# EAGLE design Tempus B (EAGLE 7.6.0)
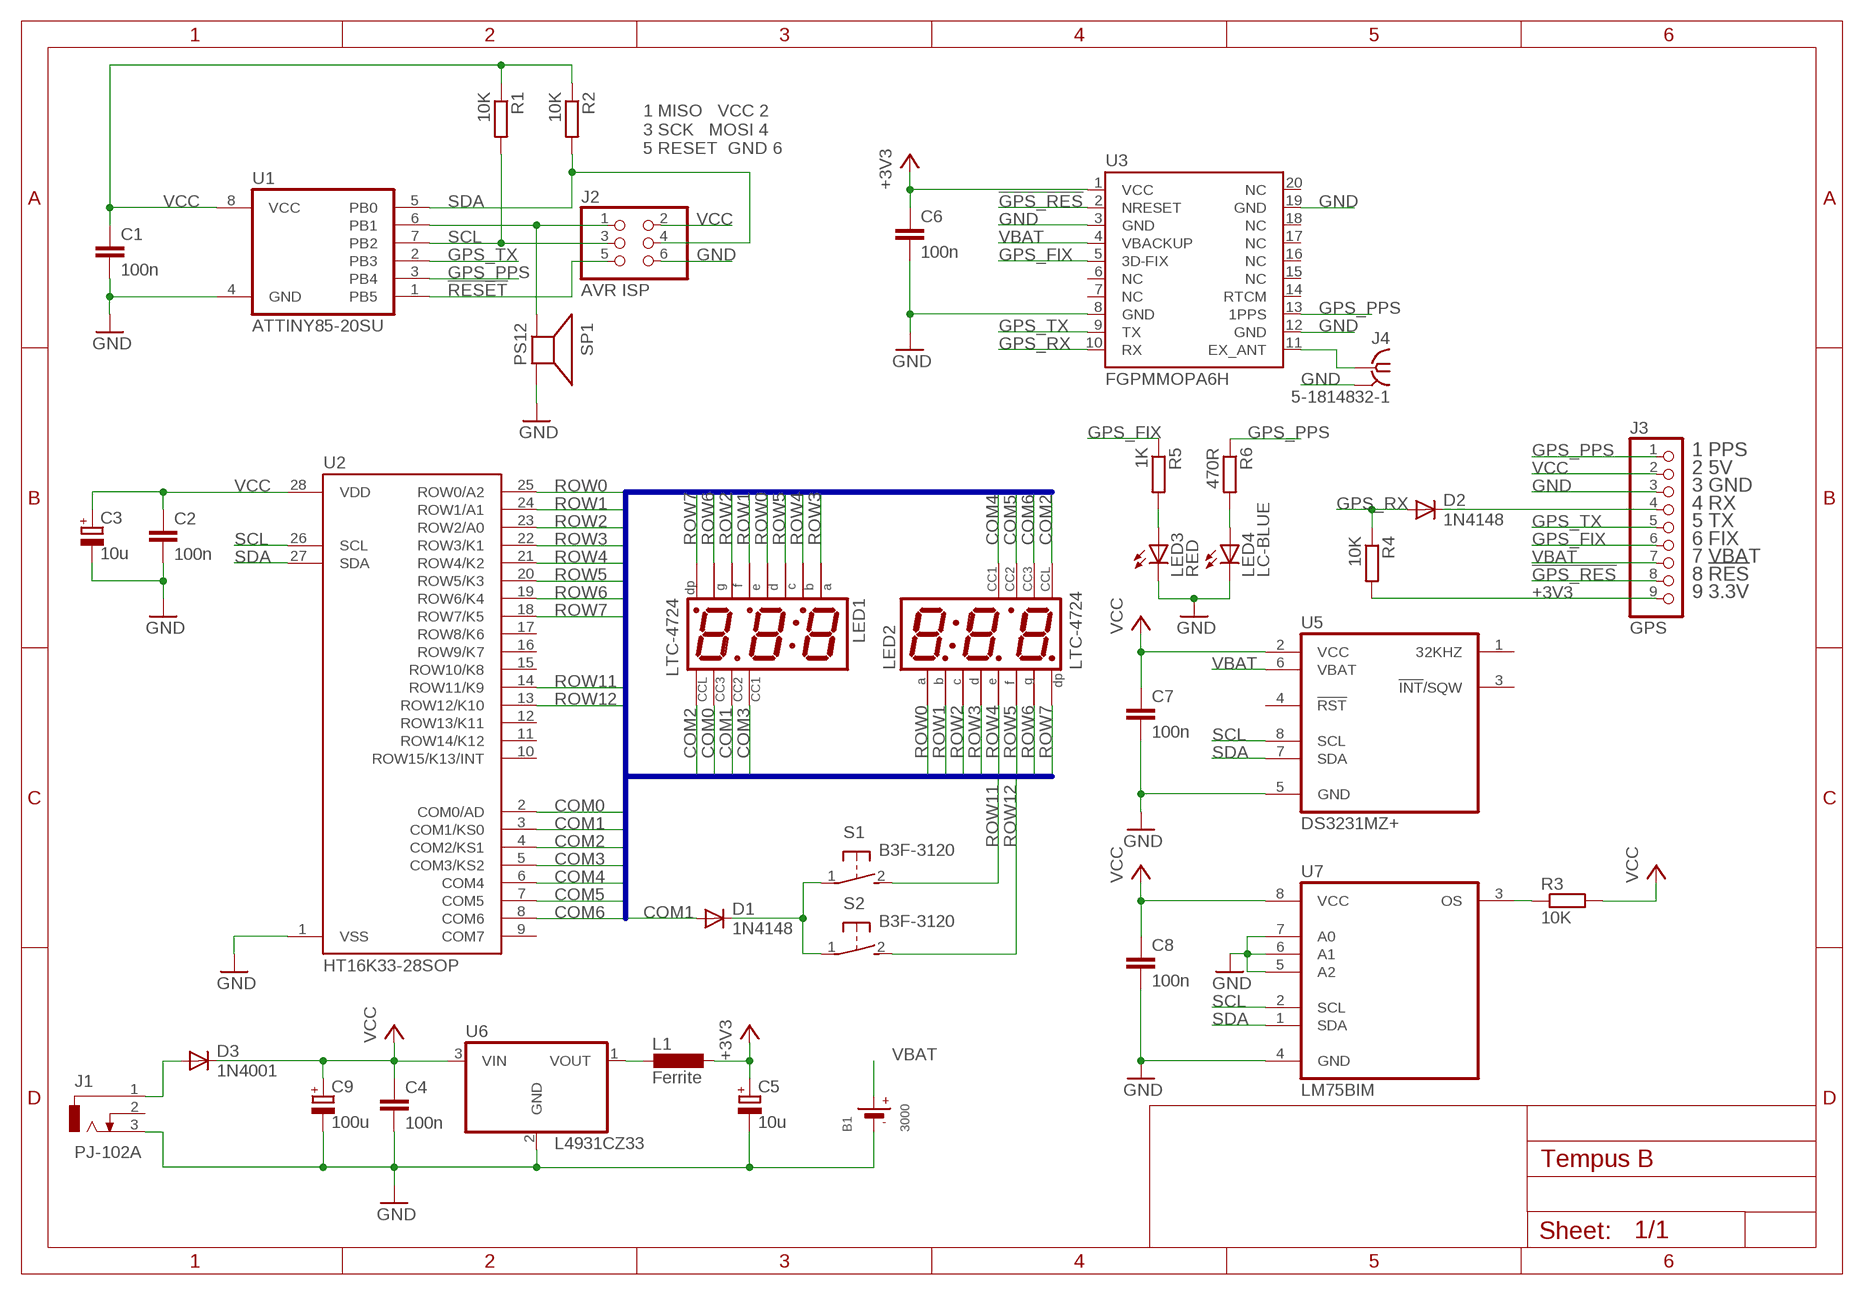
[diagram p0: schematic, sheet 1]

## Parts
B1  3000  BATTERYCR1220_SMT  [CR1220]
C1  100n  C-EUC1206  [C1206]
C2  100n  C-EUC1206  [C1206]
C3  10u  CPOL-EUE2-5  [E2-5]
C4  100n  C-EUC1206  [C1206]
C5  10u  CPOL-EUE2-5  [E2-5]
C6  100n  C-EUC1206  [C1206]
C7  100n  C-EUC1206  [C1206]
C8  100n  C-EUC1206  [C1206]
C9  100u  CPOL-EUE2-5  [E2-5]
D1  1N4148  1N4148DO35-10  [DO35-10]
D2  1N4148  1N4148DO35-10  [DO35-10]
D3  1N4001  1N4004  [DO41-10]
J1  PJ-102A  DCJACK-2.0MM  [DCJACK-2.0MM]
J2  AVR ISP  PINHD-2X3  [2X03]
J3  GPS  PINHD-1X9  [1X09]
J4  5-1814832-1  SMA-TH-ST  [SMA-TH-ST]
L1  Ferrite  L-EUL3216C  [L3216C]
LED1  LTC-4724  [DIL15-LTC-4724]
LED2  LTC-4724  [DIL15-LTC-4724]
LED3  RED  LEDCHIPLED_1206  [CHIPLED_1206]
LED4  LC-BLUE  LEDCHIPLED_1206  [CHIPLED_1206]
R1  10K  R-EU_R1206  [R1206]
R2  10K  R-EU_R1206  [R1206]
R3  10K  R-EU_R1206  [R1206]
R4  10K  R-EU_R1206  [R1206]
R5  1K  R-EU_R1206  [R1206]
R6  470R  R-EU_R1206  [R1206]
S1  B3F-3120  31-XX  [B3F-31XX]
S2  B3F-3120  31-XX  [B3F-31XX]
SP1  PS12  SPEAKER/PS12  [PS12]
U1  ATTINY85-20SU  [SO08-EIAJ]
U2  HT16K33-28SOP  [SO28W]
U3  FGPMMOPA6H  GPS_FGPMMOPA6H  [FGPMMOPA6H]
U5  DS3231MZ+  [SO08]
U6  L4931CZ33  [TO92-LINE]
U7  LM75BIM  [SO08]

## Nets
!GPS_RES: J3.8 U3.2(NRESET)
!RESET: J2.5 U1.1(PB5)
+3V3 [Power]: C5.+ C6.1 J3.9 L1.1 R4.2 U3.1(VCC)
COM0: LED1.7(CC3) U2.2(COM0/AD)
COM1: D1.A LED1.5(CC2) U2.3(COM1/KS0)
COM2: LED1.14(CCL) LED2.14(CCL) U2.4(COM2/KS1)
COM3: LED1.1(CC1) U2.5(COM3/KS2)
COM4: LED2.1(CC1) U2.6(COM4)
COM5: LED2.5(CC2) U2.7(COM5)
COM6: LED2.7(CC3) U2.8(COM6)
GND [Power]: B1.- C1.2 C2.2 C3.- C4.2 C5.- C6.2 C7.2 C8.2 C9.- J1.3 J2.6 J3.3 J4.2 J4.3 J4.4 J4.5 LED3.C LED4.C SP1.P$2(-) U1.4(GND) U2.1(VSS) U3.3(GND) U3.8(GND) U3.12(GND) U3.19(GND) U5.5(GND) U6.2(GND) U7.4(GND) U7.5(A2) U7.6(A1) U7.7(A0)
GPS_FIX: J3.6 R5.1 U3.5(3D-FIX)
GPS_PPS: J3.1 R6.1 U1.3(PB4) U3.13(1PPS)
GPS_RX: D2.A R4.1 U3.10(RX)
GPS_TX: J3.5 U1.2(PB3) U3.9(TX)
N$1: D1.C S1.1(P) S2.1(P)
N$2 [Power]: D3.A J1.1
N$3: J2.1 SP1.P$1(+) U1.6(PB1)
N$4: LED3.A R5.2
N$5: J4.1 U3.11(EX_ANT)
N$6: R3.1 U7.3(OS)
N$7 [Power]: L1.2 U6.1(VOUT)
N$8: LED4.A R6.2
N$9: D2.C J3.4
ROW0: LED1.4(D) LED2.12(A) U2.25(ROW0/A2)
ROW1: LED1.2(E) LED2.11(B) U2.24(ROW1/A1)
ROW2: LED1.15(F) LED2.3(C) U2.23(ROW2/A0)
ROW3: LED1.12(A) LED2.4(D) U2.22(ROW3/K1)
ROW4: LED1.11(B) LED2.2(E) U2.21(ROW4/K2)
ROW5: LED1.3(C) LED2.15(F) U2.20(ROW5/K3)
ROW6: LED1.8(G) LED2.8(G) U2.19(ROW6/K4)
ROW7: LED1.6(DP) LED2.6(DP) U2.18(ROW7/K5)
ROW11: S1.2(S) U2.14(ROW11/K9)
ROW12: S2.2(S) U2.13(ROW12/K10)
SCL: J2.3 R1.2 U1.7(PB2) U2.26(SCL) U5.8(SCL) U7.2(SCL)
SDA: J2.4 R2.2 U1.5(PB0) U2.27(SDA) U5.7(SDA) U7.1(SDA)
VBAT: B1.+$1(+) J3.7 U3.4(VBACKUP) U5.6(VBAT)
VCC [Power]: C1.1 C2.1 C3.+ C4.1 C7.1 C8.1 C9.+ D3.C J2.2 J3.2 R1.1 R2.1 R3.2 U1.8(VCC) U2.28(VDD) U5.2(VCC) U6.3(VIN) U7.8(VCC)
Unconnected: J1.2 U2.9(COM7) U2.10(ROW15/K13/INT) U2.11(ROW14/K12) U2.12(ROW13/K11) U2.15(ROW10/K8) U2.16(ROW9/K7) U2.17(ROW8/K6) U3.6(NC) U3.7(NC) U3.14(RTCM) U3.15(NC) U3.16(NC) U3.17(NC) U3.18(NC) U3.20(NC) U5.1(32KHZ) U5.3(!INT!/SQW) U5.4(!RST)

## Buses
ROW[0..14],COM[0..7]

## Notes on the sheet
- 1 MISO   VCC 2
  3 SCK   MOSI 4
  5 RESET  GND 6
- 1 PPS
  2 5V
  3 GND
  4 RX
  5 TX
  6 FIX
  7 VBAT
  8 !RES
  9 3.3V

## Library data of the parts
B1 = collected:BATTERY: CR1220 SMT - Digikey: 3001K-ND CD2032 BAT-HLD-001 - Digikey: BAT-HLD-001-ND Collected from microbuilder.lbr exported from coin20mm.sch from Adafruit SMT Breakout PCBs repository
C1 C2 C4 C6-C8 = rcl:C-EU: CAPACITOR, European symbol
C3 C5 C9 = rcl:CPOL-EU: POLARIZED CAPACITOR, European symbol
D1 D2 = diode:1N4148: DIODE high speed (Philips)
D3 = diode:1N4004: DIODE general purpose rectifier, 1 A
J1 = ndabas:DCJACK-: DC POWER JACK
J2 = pinhead:PINHD-2X3: PIN HEADER
J3 = pinhead:PINHD-1X9: PIN HEADER
J4 = ndabas:SMA-: FEMALE SMA CONNECTOR Copied from con-coax.lbr and drill sizes fixed.; OC_FARNELL: unknown; OC_NEWARK: unknown
L1 = rcl:L-EU: INDUCTOR, European symbol
LED1 LED2 = ndabas:LTC-4724: 10mm 3-digit 7-segment multiplexed common cathode display
LED3 LED4 = led:LED: LED OSRAM: - CHIPLED LG R971, LG N971, LY N971, LG Q971, LY Q971, LO R971, LY R971 LH N974, LH R974 LS Q976, LO Q976, LY Q976 LO Q996 - Hyper CHIPLED LW Q18S LB Q993, LB Q99A, LB R99A - SideLED LS A670, LO A670, LY A670, LG A670, LP A670 LB A673, LV A673, LT A673, LW A673 LH A674 LY A675 LS A676, LA A676, LO A676, LY A676, LW A676 LS A679, LY A679, LG A679 - Hyper Micro SIDELED® LS Y876, LA Y876, LO Y876, LY Y876 LT Y87S - SmartLED LW L88C, LW L88S LB L89C, LB L89S, LG L890 LS L89K, LO L89K, LY L89K LS L896, LA L896, LO L896, LY L896 - TOPLED LS T670, LO T670, LY T670, LG T670, LP T670 LSG T670, LSP T670, LSY T670, LOP T670, LYG T670 LG T671, LOG T671, LSG T671 LB T673, LV T673, LT T673, LW T673 LH T674 LS T676, LA T676, LO T676, LY T676, LB T676, LH T676, LSB T676, LW T676 LB T67C, LV T67C, LT T67C, LS T67K, LO T67K, LY T67K, LW E67C LS E67B, LA E67B, LO E67B, LY E67B, LB E67C, LV E67C, LT E67C LW T67C LS T679, LY T679, LG T679 LS T770, LO T770, LY T770, LG T770, LP T770 LB T773, LV T773, LT T773, LW T773 LH T774 LS E675, LA E675, LY E675, LS T675 LS T776, LA T776, LO T776, LY T776, LB T776 LHGB T686 LT T68C, LB T68C - Hyper Mini TOPLED® LB M676 - Mini TOPLED Santana® LG M470 LS M47K, LO M47K, LY M47K Source: http://www.osram.convergy.de LUXEON: - LUMILED® LXK2-PW12-R00, LXK2-PW12-S00, LXK2-PW14-U00, LXK2-PW14-V00 LXK2-PM12-R00, LXK2-PM12-S00, LXK2-PM14-U00 LXK2-PE12-Q00, LXK2-PE12-R00, LXK2-PE12-S00, LXK2-PE14-T00, LXK2-PE14-U00 LXK2-PB12-K00, LXK2-PB12-L00, LXK2-PB12-M00, LXK2-PB14-N00, LXK2-PB14-P00, LXK2-PB14-Q00 LXK2-PR12-L00, LXK2-PR12-M00, LXK2-PR14-Q00, LXK2-PR14-R00 LXK2-PD12-Q00, LXK2-PD12-R00, LXK2-PD12-S00 LXK2-PH12-R00, LXK2-PH12-S00 LXK2-PL12-P00, LXK2-PL12-Q00, LXK2-PL12-R00 Source: www.luxeon.com KINGBRIGHT: KA-3528ASYC Source: www.kingbright.com
R1-R6 = rcl:R-EU_: RESISTOR, European symbol
S1 S2 = switch-omron:31-XX: OMRON SWITCH; MPN: B3F-3100; OC_FARNELL: 959704; OC_NEWARK: 36M3582
SP1 = adafruit:SPEAKER: SPEAKER Source: Buerklin Added PS12 (for part # PS1240 piezo) http://www.ladyada.net/library/pcb/eaglelibrary.html
U1 = ndabas:ATTINY85*-: Atmel 8-bit AVR Microcontroller with 8K Bytes In-System Programmable Flash Operating Voltage 1.8 - 5.5V for ATtiny25V/45V/85V 2.7 - 5.5V for ATtiny25/45/85 Speed Grade ATtiny25V/45V/85V: 0 – 4 MHz @ 1.8 - 5.5V, 0 - 10 MHz @ 2.7 - 5.5V ATtiny25/45/85: 0 – 10 MHz @ 2.7 - 5.5V, 0 - 20 MHz @ 4.5 - 5.5V
U2 = ndabas:HT16K33-: RAM Mapping 16*8 LED Controller Driver with keyscan
U3 = ndabas:GPS_FGPMMOPA6H: GPS Module Ladybird 1 (PA6H)
U5 = ndabas:DS3231M: ±5ppm, I2C Real-Time Clock
U6 = ndabas:L4931?*: Very low drop voltage regulator
U7 = ndabas:LM75: Digital Temperature Sensor and Thermal Watchdog with 2-Wire Interface

## Net classes
0 default: width 0.305 mm, clearance 0.203 mm
1 Power: width 0.406 mm, clearance 0.203 mm

## Board
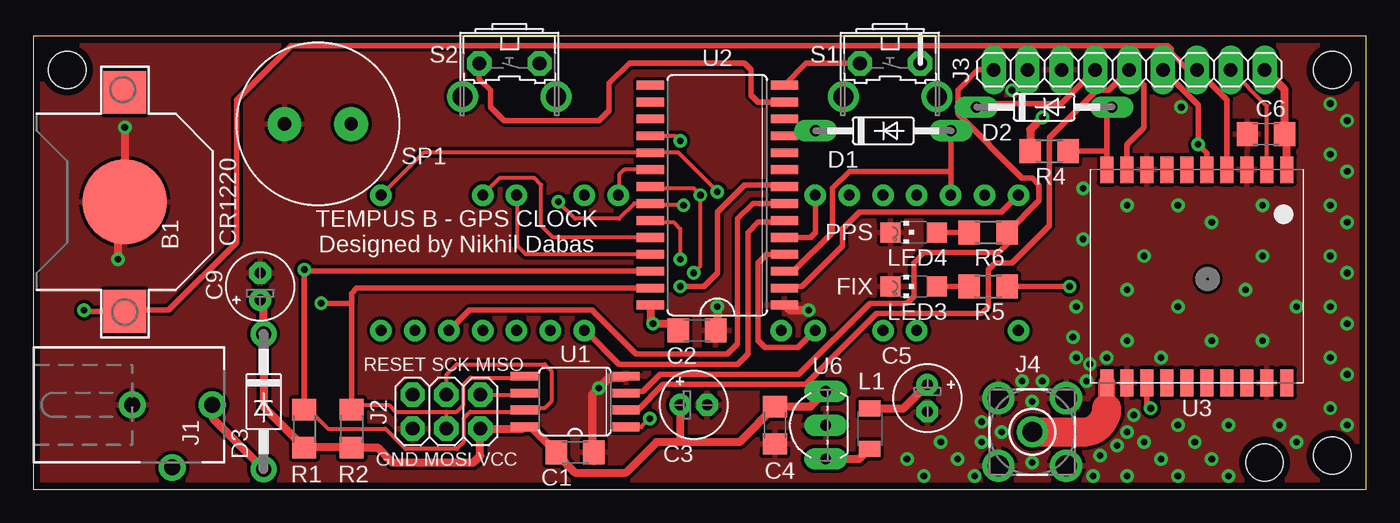
[diagram p1: board, top side]
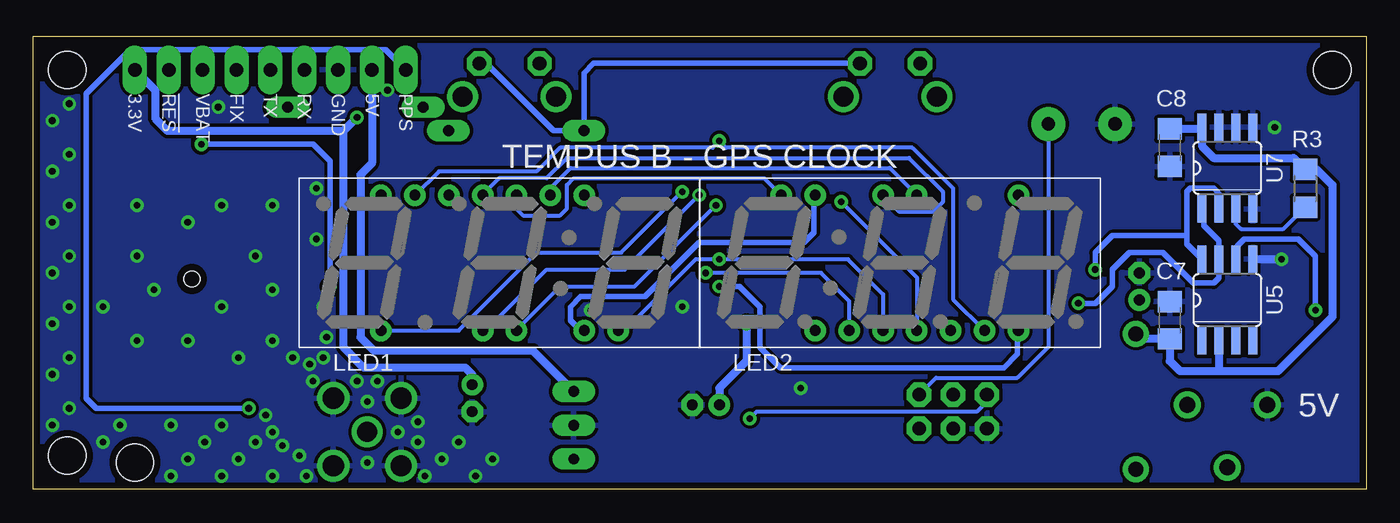
[diagram p2: board, bottom side, seen from below]

Size 99.97 x 34.04 mm. Coordinates in mm from the lower left corner, seen from the top.
Outline: 0,0 99.97,0 99.97,34.04 0,34.04 0,0
Copper layers (1*16): Top 0.035mm / dielectric 1.5mm / Bottom 0.035mm
Design rules "my-easysolder": minimum track width 8mil, minimum drill 14mil, track to track 8mil, track to pad 8mil, pad to pad 8mil, via to via 8mil, smd to smd 8mil, copper to edge 20mil, drill to drill 10mil, minimum pad ring 16mil, minimum via ring 10mil, stop-mask expansion 4mil, vias tented up to drill 20mil, thermal gap 10mil
Holes 2.8 mm at 92.35,2.03 97.43,31.5 2.54,31.5 97.43,2.54

### Footprints (pad centres in the part's own frame; a part is rotated, then mirrored left to right if it is on the bottom)
CR1220 = smd 3.2 x 3.2: +$1 -8.225,0; +$2 8.225,0 | smd 6.35 x 6.35: - 0,0
C1206 = smd 1.6 x 1.8: 1 -1.4,0; 2 1.4,0
E2-5 = drill 0.813 pad 1.27: + -1.016,0 | drill 0.813 pad 1.27 octagon: - 1.016,0
DO35-10 = drill 0.813 long: A 5.08,0; C -5.08,0
DO41-10 = drill 1.118: A 5.08,0; C -5.08,0
DCJACK-2.0MM = drill 1.2: 1 0,2.997; 2 4.699,0; 3 0,-2.997
2X03 = drill 1.016 octagon: 1 -2.54,-1.27; 2 -2.54,1.27; 3 0,-1.27; 4 0,1.27; 5 2.54,-1.27; 6 2.54,1.27
1X09 = drill 1.016 long: 1 -10.16,0; 2 -7.62,0; 3 -5.08,0; 4 -2.54,0; 5 0,0; 6 2.54,0; 7 5.08,0; 8 7.62,0; 9 10.16,0
SMA-TH-ST = drill 1.5: 1 0,0 | drill 1.6: 2 -2.54,2.54; 3 2.54,2.54; 4 2.54,-2.54; 5 -2.54,-2.54
L3216C = smd 1.2 x 1.6: 1 -1.5,0; 2 1.5,0
DIL15-LTC-4724 = drill 0.8: 1 -6.35,-5.08; 2 -3.81,-5.08; 3 -1.27,-5.08; 4 1.27,-5.08; 5 3.81,-5.08; 6 6.35,-5.08; 7 8.89,-5.08; 8 8.89,5.08; 11 1.27,5.08; 12 -1.27,5.08; 14 -6.35,5.08; 15 -8.89,5.08
CHIPLED_1206 = smd 1.5 x 1.5: A 0,-1.75; C 0,1.75
R1206 = smd 1.6 x 1.803: 1 -1.422,0; 2 1.422,0
B3F-31XX = drill 1.016 octagon: 1 -2.261,-1.245; 2 2.261,-1.245 | drill 1.499 pad 2.159: 3 -3.505,1.245; 4 3.505,1.245
PS12 = drill 1 pad 2.54: P$1 -2.5,0; P$2 2.5,0
SO08-EIAJ = smd 0.66 x 2.032: 1 -1.905,-3.81; 2 -0.635,-3.81; 3 0.635,-3.81; 4 1.905,-3.81; 5 1.905,3.81; 6 0.635,3.81; 7 -0.635,3.81; 8 -1.905,3.81
SO28W = smd 0.66 x 2.032: 1 -8.255,-5.029; 2 -6.985,-5.029; 3 -5.715,-5.029; 4 -4.445,-5.029; 5 -3.175,-5.029; 6 -1.905,-5.029; 7 -0.635,-5.029; 8 0.635,-5.029; 9 1.905,-5.029; 10 3.175,-5.029; 11 4.445,-5.029; 12 5.715,-5.029; 13 6.985,-5.029; 14 8.255,-5.029; 15 8.255,5.029; 16 6.985,5.029; 17 5.715,5.029; 18 4.445,5.029; 19 3.175,5.029; 20 1.905,5.029; 21 0.635,5.029; 22 -0.635,5.029; 23 -1.905,5.029; 24 -3.175,5.029; 25 -4.445,5.029; 26 -5.715,5.029; 27 -6.985,5.029; 28 -8.255,5.029
FGPMMOPA6H = smd 2 x 1: 1 -8,6.75; 2 -8,5.25; 3 -8,3.75; 4 -8,2.25; 5 -8,0.75; 6 -8,-0.75; 7 -8,-2.25; 8 -8,-3.75; 9 -8,-5.25; 10 -8,-6.75; 11 8,-6.75; 12 8,-5.25; 13 8,-3.75; 14 8,-2.25; 15 8,-0.75; 16 8,0.75; 17 8,2.25; 18 8,3.75; 19 8,5.25; 20 8,6.75 | hole 1.2: 0.2,0.8
SO08 = smd 0.66 x 2.032: 1 -1.905,-3.073; 2 -0.635,-3.073; 3 0.635,-3.073; 4 1.905,-3.073; 5 1.905,3.073; 6 0.635,3.073; 7 -0.635,3.073; 8 -1.905,3.073
TO92-LINE = drill 0.813 long: 1 -2.54,0; 2 0,0; 3 2.54,0

### Placement (x,y rotation side)
B1  6.86,21.59 90 top
C1  40.64,2.79 0 top
C2  49.78,11.94 0 top
C3  49.53,6.35 0 top
C4  55.63,4.83 270 top
C5  67.06,6.86 270 top
C6  92.46,26.67 180 top
C7  14.73,12.7 90 bottom
C8  14.73,25.65 270 bottom
C9  17.02,15.24 90 top
D1  63.75,26.92 0 top
D2  75.82,28.7 0 top
D3  17.27,6.6 270 top
J1  10.41,6.35 270 top
J2  30.99,5.84 180 top
J3  82.19,31.5 0 top
J4  74.93,4.32 0 top
L1  62.74,4.57 270 top
LED1  65,17.02 180 bottom
LED2  34.98,17.02 0 bottom
LED3  66.04,15.24 90 top
LED4  66.04,19.3 90 top
R1  20.32,4.57 90 top
R2  23.88,4.57 90 top
R3  4.57,22.61 90 bottom
R4  76.2,25.4 180 top
R5  71.63,15.24 180 top
R6  71.63,19.3 180 top
S1  64.26,30.73 180 top
S2  35.71,30.73 180 top
SP1  21.34,27.43 180 top
U1  40.64,6.6 90 top
U2  51.31,22.1 90 top
U3  87.27,16 270 top
U5  10.41,14.22 0 bottom
U6  59.44,4.83 90 top
U7  10.41,24.13 0 bottom

### Tracks (layer width: path | path; a pad name or v marks a point on that pad's centre or on a via)
!GPS_RES
  Top 0.305: U3.2 92.52,28.79 J3.8
!RESET  (via drill 0.5)
  Top 0.305: 44.58,4.83 U1.1 45.59,4.7 v46.23,5.33
  Bottom 0.305: J2.5 28.45,6.6 29.21,5.84 45.72,5.84 v46.23,5.33
+3V3  (via drill 0.5)
  Top 0.406: R4.2 74.93,25.55
  Top 0.61: L1.1 65.25,6.07 C5.+ | U3.1 94.02,26.5 C6.1 93.86,29.99 J3.9 | v75.69,27.94 74.78,27.03 R4.2
  Bottom 0.61: C5.+ 67.06,8.64 67.56,9.14 75.18,9.14 76.71,10.67 76.71,26.92 | 76.71,26.92 v75.69,27.94 | J3.9 90.83,29.97 90.83,27.84 89.92,26.92 76.71,26.92
COM0
  Top 0.305: 56.46,15.24 U2.2
  Top 0.406: 56.46,15.24 57.66,15.24 60.71,18.29 60.71,19.56 61.98,20.83 72.62,20.83 LED1.7
COM1
  Top 0.406: U2.3 57.02,16.38 59.94,19.3 59.94,22.61 61.21,23.88 68.83,23.88 | LED1.5 68.83,22.12 68.83,23.88 | 68.83,23.88 D1.A
COM2
  Top 0.406: U2.4 54.99,17.65 54.36,17.02 54.36,11.18 54.86,10.67 57.35,10.67 58.62,11.94 LED1.14
  Bottom 0.406: LED2.14 41.35,22.1 41.4,22.05 41.4,19.3 42.16,18.54 50.04,18.54 54.1,14.48 58.93,14.48 59.69,13.72 59.69,12.7 58.93,11.94 LED1.14
COM3
  Top 0.406: U2.5 58.29,18.92 58.67,19.3 58.67,22.05 58.65,22.07 LED1.1
COM4
  Top 0.305: 56.21,20.07 U2.6
  Top 0.406: 56.21,20.07 54.36,20.07 53.59,19.3 53.59,10.16 52.83,9.4 43.94,9.4 41.4,11.94 LED2.1
COM5
  Top 0.406: U2.7 53.98,21.46 52.83,20.32 52.83,10.92 52.07,10.16 45.21,10.16 41.91,13.46 32.72,13.46 31.19,11.94 LED2.5
COM6  (via drill 0.5)
  Top 0.406: U2.8 56.34,22.86 53.34,22.86 51.31,20.83 51.31,16.26 50.29,15.24 v48.51,15.24
  Bottom 0.406: v48.51,15.24 46.99,15.24 45.47,13.72 45.47,10.67 43.94,9.14 27.18,9.14 26.16,10.16 26.16,11.89 26.11,11.94 LED2.7
GND  (via drill 0.5)
  Top 0.61: v6.35,17.27 6.35,21.08 B1.- 6.35,22.1 6.86,22.1 v6.86,27.18 | U1.4 44.32,8.38 43.18,8.38 v42.42,7.62 41.91,7.11 41.91,2.79 C1.2 | 50.8,12.32 C2.2 51.31,12.06 v51.31,13.72 | U2.1 56.72,13.46 v58.17,13.46
  Bottom 0.61: U5.5 6.38,17.3 v6.35,17.27
  other vias: 86.11,28.7 80.01,2.54 74.93,2.03 72.64,4.32 74.93,6.6 71.12,5.08 71.12,3.56 74.17,8.13 75.69,8.13 78.99,8.13 79.25,9.4 80.52,9.91 81.28,3.3 82.04,4.32 82.55,5.59 79.5,1.02 82.04,1.02 85.85,1.02 89.66,1.02 83.31,3.56 87.12,3.56 85.85,4.83 89.66,4.83 84.58,2.29 88.39,2.29 93.47,4.83 94.74,3.56 98.55,4.83 98.55,8.64 98.55,12.45 98.55,16.26 98.55,20.07 98.55,23.88 98.55,27.69 97.28,6.1 97.28,9.91 97.28,13.72 97.28,17.53 97.28,21.34 97.28,25.15 97.28,28.96 78.23,9.91 78.23,13.72 82.04,21.34 92.2,21.34 92.2,11.18 82.04,11.18 83.31,17.53 88.39,20.07 94.74,13.72 88.39,11.18 82.04,14.99 92.2,17.53 85.85,13.72 85.85,21.34 90.93,14.99 84.58,9.91 78.74,22.61 78.74,18.8 77.98,11.43 70.61,1.02 66.8,1.02 69.34,2.29 68.07,3.56 65.53,2.29 73.41,29.97
  pour Bottom (isolate 0.254): 0,0 0,34.04 99.97,34.04 99.97,0
  pour Top (isolate 0.254): 0,0 0,34.04 99.97,34.04 99.97,0
GPS_FIX  (via drill 0.5)
  Top 0.406: U3.5 88.02,25.26 v87.38,25.91 87.38,28.85 J3.6 | v77.72,15.24 R5.1
  Bottom 0.406: v87.38,25.91 78.99,25.91 77.72,24.64 v77.72,15.24
GPS_PPS  (via drill 0.5)
  Top 0.305: 44.58,7.37 U1.3
  Top 0.406: 44.58,7.37 45.72,7.37 46.99,8.64 57.4,8.64 62.74,13.97 65.53,13.97 66.04,14.48 66.04,17.02 66.8,17.78 72.39,17.78 73.05,18.44 R6.1 75.44,21.69 75.44,22.86 74.93,23.37 74.17,23.37 69.34,28.19 69.34,29.97 70.87,31.5 J3.1 | U3.13 83.52,6.39 v83.82,6.1
  Bottom 0.406: J3.1 73.56,33.02 92.71,33.02 96.01,29.72 96.01,6.86 95.25,6.1 v83.82,6.1
GPS_RX
  Top 0.406: U3.10 80.52,25.4 | 80.52,25.4 80.52,28.35 80.55,28.35 D2.A | R4.1 80.52,25.4
GPS_TX
  Top 0.406: U1.2 45.34,5.97 47.24,7.87 57.91,7.87 63.25,13.21 71.12,13.21 71.63,13.72 71.63,16.51 72.14,17.02 73.41,17.02 76.2,19.81 76.2,26.42 79.76,29.97 80.67,29.97 J3.5 | U3.9 82.02,25.89 83.31,27.18 83.31,30.38 J3.5 | 82.19,31.39 J3.5
N$1
  Bottom 0.406: S2.1 57.94,31.98 58.67,31.24 D1.C 60.96,26.92 66.02,31.98 S1.1
N$2
  Top 0.61: D3.A 13.46,5.33 13.46,6.35 J1.1
N$3
  Top 0.305: J2.1 36.7,7.11 U1.6
  Bottom 0.305: J2.1 32.26,8.38 26.16,8.38 23.84,10.71 SP1.P$1
N$4
  Top 0.406: LED3.A R5.2
N$5
  Top 1.27: 80.52,6.1 U3.11 arc-90 U3.11
  Top 2.184: J4.1 78.74,4.32 arc90 80.52,6.1
N$6
  Bottom 0.305: 9.91,21.18 U7.3 9.78,19.94 9.4,19.56 6.2,19.56 R3.1
N$7
  Top 0.61: U6.1 61.95,2.29 L1.2
N$8
  Top 0.406: LED4.A R6.2
N$9
  Top 0.406: J3.4 77.11,28.96 70.97,28.96 70.97,28.93 D2.C
ROW0
  Top 0.305: U2.25 36.96,17.65 36.32,18.29 36.32,22.05 36.3,22.05 LED2.12
  Bottom 0.305: LED2.12 36.25,22.07 35,20.83 32.51,20.83 31.75,21.59 31.75,22.35 34.29,24.89 59.94,24.89 61.47,23.37 65.02,23.37 66.27,22.12 LED1.4
ROW1
  Top 0.305: U2.24 38.99,18.92 38.1,19.81 38.1,22.86 37.59,23.37 34.98,23.37 LED2.11
  Bottom 0.305: LED2.11 35.74,24.13 59.69,24.13 61.19,22.63 LED1.2
ROW2  (via drill 0.5)
  Top 0.305: U2.23 46.41,20.07 48.01,20.07 48.51,19.56 v48.51,17.27
  Bottom 0.305: LED2.3 36.25,14.66 38.86,17.27 v48.51,17.27 50.29,17.27 55.63,11.94 LED1.15
ROW3  (via drill 0.5)
  Top 0.305: v48.77,21.34 46.41,21.34 U2.22 45.09,21.46 43.94,20.32 40.64,20.32 v39.37,21.59
  Bottom 0.305: v48.77,21.34 54.86,15.24 60.45,15.24 63.73,11.96 LED1.12 | LED2.4 33.71,15.93 v39.37,21.59
ROW4  (via drill 0.5)
  Top 0.305: U2.21 46.41,22.61 49.53,22.61 v50.04,22.1 | v50.04,22.1 50.29,21.84 | v49.53,16.26 50.04,16.76 v50.04,22.1
  Bottom 0.305: LED1.11 66.04,11.94 61.47,16.51 55.63,16.51 v50.04,22.1 | v49.53,16.26 40.89,16.26 38.79,14.15 LED2.2
ROW5
  Top 0.305: U2.20 44.32,24 43.94,23.62 43.94,22.15 43.92,22.15 LED2.15
  Bottom 0.305: LED2.15 43.89,22.1 45.16,23.37 59.44,23.37 59.94,22.86 59.94,21.08 60.45,20.57 63.25,20.57 63.73,21.06 LED1.3
ROW6  (via drill 0.5)
  Top 0.305: v51.31,22.35 48.39,25.27 U2.19 29.26,25.27 LED2.8
  Bottom 0.305: v51.31,22.35 55.88,17.78 62.23,17.78 68.07,11.94 LED1.8
ROW7  (via drill 0.5)
  Top 0.305: U2.18 48.13,26.54 v48.51,26.16
  Bottom 0.305: LED2.6 28.65,11.94 30.99,14.28 30.99,22.61 34.04,25.65 48.01,25.65 v48.51,26.16 49.02,25.65 60.45,25.65 62.23,23.88 69.55,23.88 71.32,22.1 LED1.6
ROW11
  Top 0.406: U2.14 57.96,31.98 S1.2
ROW12
  Top 0.406: U2.13 54.36,29.08 53.85,29.59 53.85,31.5 53.34,32 44.7,32 43.18,30.48 43.18,28.45 42.42,27.69 35.31,27.69 34.29,28.7 34.29,29.97 33.45,30.81 S2.2
SCL  (via drill 0.5)
  Top 0.305: R1.2 20.68,5.99 22.1,4.57 26.42,4.57 27.94,3.05 31.75,3.05 32.26,3.56 32.26,5.33 32.77,5.84 36.7,5.84 U1.7 36.96,6.1 38.35,6.1 38.86,6.6 38.86,8.89 38.35,9.4 31.75,9.4 30.99,8.64 J2.3
  Top 0.406: U2.26 20.45,16.38 v20.32,16.51 R1.2
  Bottom 0.406: U7.2 11.05,22.23 11.43,22.61 13.21,22.61 13.46,22.35 13.46,19.05 | U5.8 13.46,18.44 13.46,19.05 | 13.46,19.05 19.05,19.05 20.32,17.78 v20.32,16.51
SDA  (via drill 0.5)
  Top 0.305: U1.5 36.7,8.38 32.77,8.38 32.26,7.87 32.26,6.35 31.75,5.84 30.99,5.84 | R2.2 24.13,6.25 24.13,6.35 26.67,6.35 27.18,5.84 30.99,5.84 | J2.4 30.99,5.84
  Top 0.406: U2.27 24.26,15.11 23.88,14.73 23.88,13.97 | R2.2 23.88,13.97 | v21.59,13.97 23.88,13.97
  Bottom 0.406: U7.1 12.19,20.93 12.19,19.81 11.05,18.67 U5.7 11.05,15.88 11.43,15.49 12.95,15.49 15.24,17.78 17.78,17.78 19.05,16.51 19.05,15.24 20.32,13.97 v21.59,13.97
VBAT  (via drill 0.5)
  Top 0.406: v3.81,13.46 3.91,13.37 B1.+$1 6.96,13.46 10.16,13.46 15.24,18.54 15.24,29.21 19.36,33.33 85.09,33.33 85.34,33.07 85.34,32.77 86.61,31.5 J3.7 89.52,29.25 U3.4
  Bottom 0.406: v3.81,13.46 3.81,17.53 5.08,18.8 9.14,18.8 9.65,18.29 9.65,17.42 U5.6
VCC  (via drill 0.5)
  Top 0.61: U2.28 46.28,12.65 v46.48,12.45 47.88,12.45 C2.1 | 48.51,3.56 46.74,3.56 44.45,1.27 40.64,1.27 39.24,2.67 C1.1 37.34,4.7 U1.8 36.7,4.57 J2.2 33.53,2.54 33.02,2.03 26.92,2.03 25.81,3.15 R2.1 R1.1 17.27,6.2 D3.C 17.27,13.97 C9.+ | C3.+ 48.51,3.56 | 48.51,3.56 52.96,3.56 C4.1 58.3,6.23 U6.3
  Bottom 0.61: C8.1 12.32,27.05 U7.8 12.32,25.78 11.43,24.89 5.44,24.89 R3.2 3.71,24.03 2.54,22.86 2.54,12.95 6.6,8.89 10.92,8.89 | v46.48,12.45 46.48,9.65 48.51,7.62 C3.+ | 10.92,8.89 13.97,8.89 14.73,9.65 C7.1 16.89,11.3 D3.C | U5.2 11.05,9.02 10.92,8.89 | U6.3 62.48,10.41 74.42,10.41 75.44,11.43 75.44,23.62 74.57,24.49 J3.2

### Text on the board
tPlace: CR1220 | PPS | TEMPUS B - GPS CLOCK / Designed by Nikhil Dabas | FIX | RESET SCK MISO | GND MOSI VCC
bPlace: PPS / 5V / GND / RX / TX / FIX / VBAT / !RES / 3.3V | TEMPUS B - GPS CLOCK | 5V